# Altium schematic sheet 05)NorFlash,NandFlash.SchDoc
size 297 x 209 mm
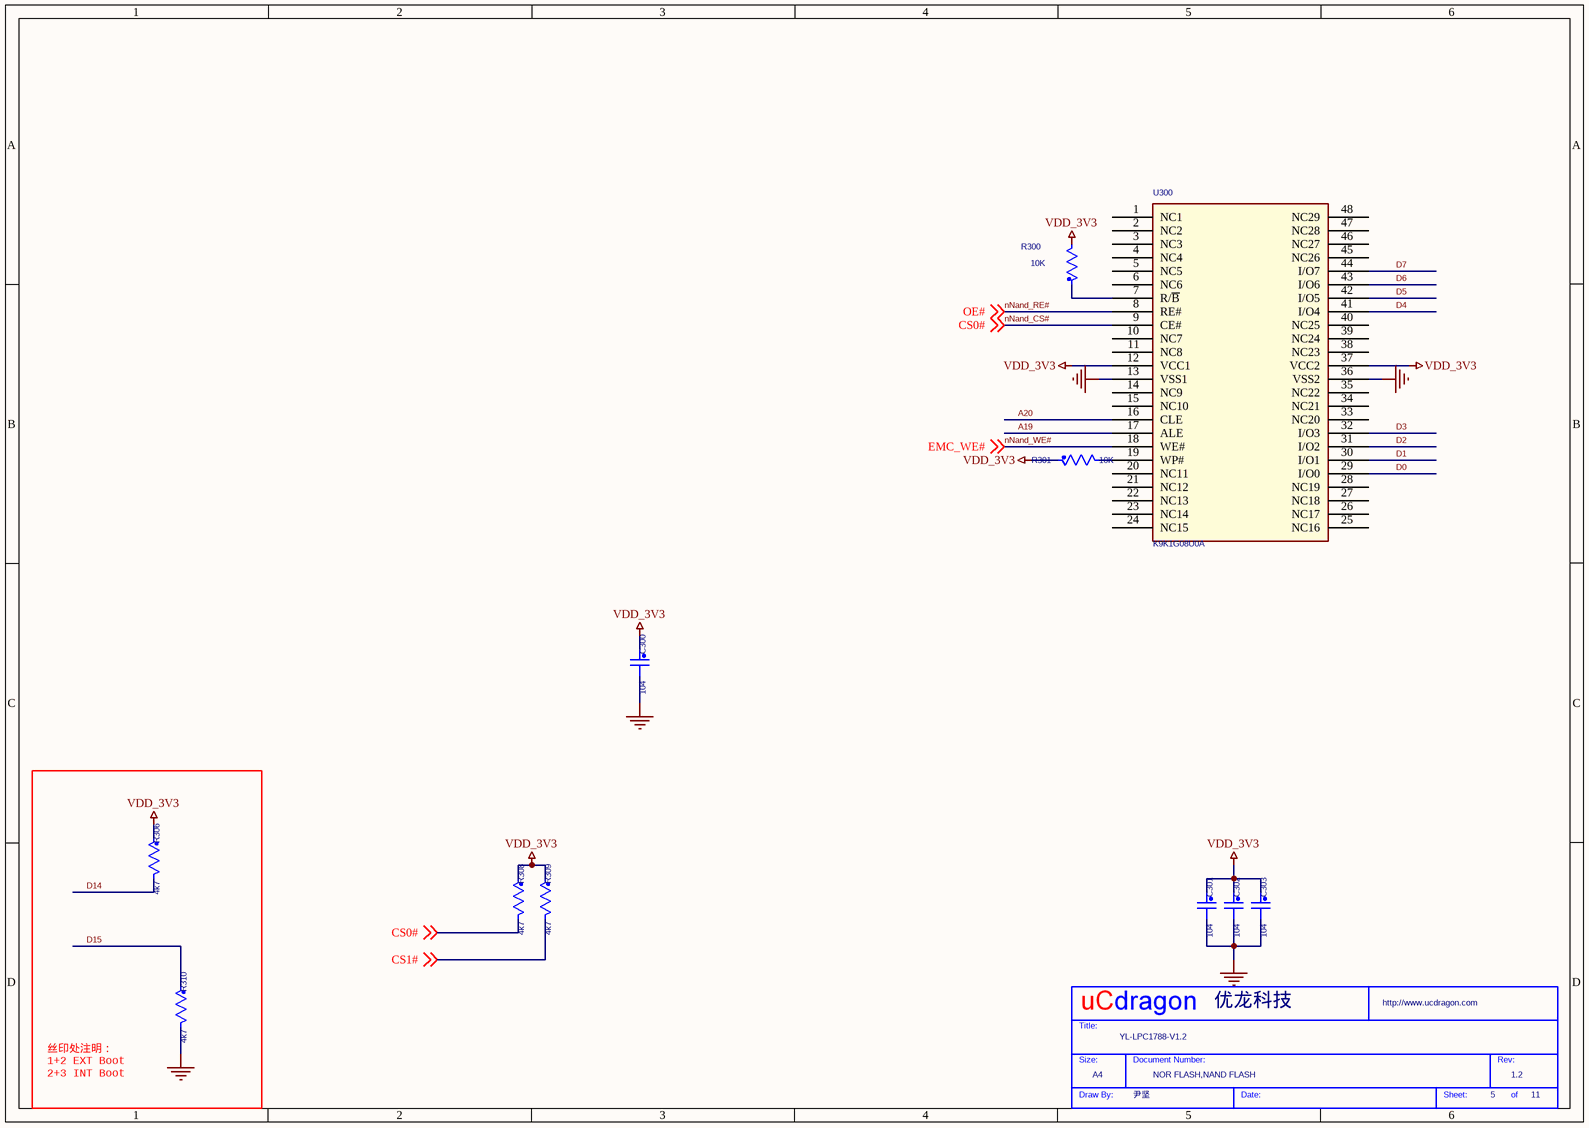
[diagram p0: 05)NorFlash,NandFlash.SchDoc]

## Parts
*  Page Count: 11  Page Number: 5  Page Size: A4  Title: YL-LPC1788-V1.2  RevCode: 1.2  Doc: NOR FLASH,NAND FLASH  Drawing: 尹坚  Company: 优龙科技  (hidden comment: My Title 0)  (graphical)
C300  104  [0603P]
C301  104  [0603P]
C302  104  [0603P]
C303  104  [0603P]
R300  10K  [0603P]
R301  10K  [0603P]
R306  4k7  [0603P]
R308  4k7  [0603P]
R309  4k7  [0603P]
R310  4k7  [0603P]
U300  K9K1G08U0A  [TSOP48]

## Nets
GND_POWER: C300.2 C301.2 C302.2 C303.2 R310.2 U300.13(VSS1) U300.36(VSS2)
VDD_3V3: C300.1 C301.1 C302.1 C303.1 R300.2 R301.1 R306.1 R308.1 R309.1 U300.12(VCC1) U300.37(VCC2)
A19: U300.17(ALE)
A20: U300.16(CLE)
CS1#: R309.2 ; off-sheet CS1#
D0: U300.29(I/O0)
D1: U300.30(I/O1)
D2: U300.31(I/O2)
D3: U300.32(I/O3)
D4: U300.41(I/O4)
D5: U300.42(I/O5)
D6: U300.43(I/O6)
D7: U300.44(I/O7)
D14: R306.2
D15: R310.1
nNand_CS#: R308.2 U300.9(CE#) ; off-sheet CS0#  [also labelled CS0#]
nNand_RE#: U300.8(RE#) ; off-sheet OE#  [also labelled OE#]
nNand_WE#: U300.18(WE#) ; off-sheet EMC_WE#  [also labelled EMC_WE#]
NetR300_1: R300.1 U300.7(R/~{B})
NetR301_2: R301.2 U300.19(WP#)

Not connected (* = marked no-connect by the designer): U300 1(NC1) 2(NC2) 3(NC3) 4(NC4) 5(NC5) 6(NC6) 10(NC7) 11(NC8) 14(NC9) 15(NC10) 20(NC11) 21(NC12) 22(NC13) 23(NC14) 24(NC15) 25(NC16) 26(NC17) 27(NC18) 28(NC19) 33(NC20) 34(NC21) 35(NC22) 38(NC23) 39(NC24) 40(NC25) 45(NC26) 46(NC27) 47(NC28) 48(NC29)

## Notes on the sheet
- (near R310) 丝印处注明：
  1+2 EXT Boot
  2+3 INT Boot
- (in symbol My Title 0) Title:; Size:; Document Number:; Rev:; Draw By:; Date:; Sheet:; of

## Library data of the parts
C300-C303 = C_Generic_Dup2
R300 R301 R306 R308-R310 = R_Generic_Dup1
* = My Title 0: Page Create Date: May 29, 2006; WebSite: http://www.ucdragon.com